# Altium schematic sheet 03_Battery Management.SchDoc
size A3; SheetNumber: 3; SheetTotal: 14
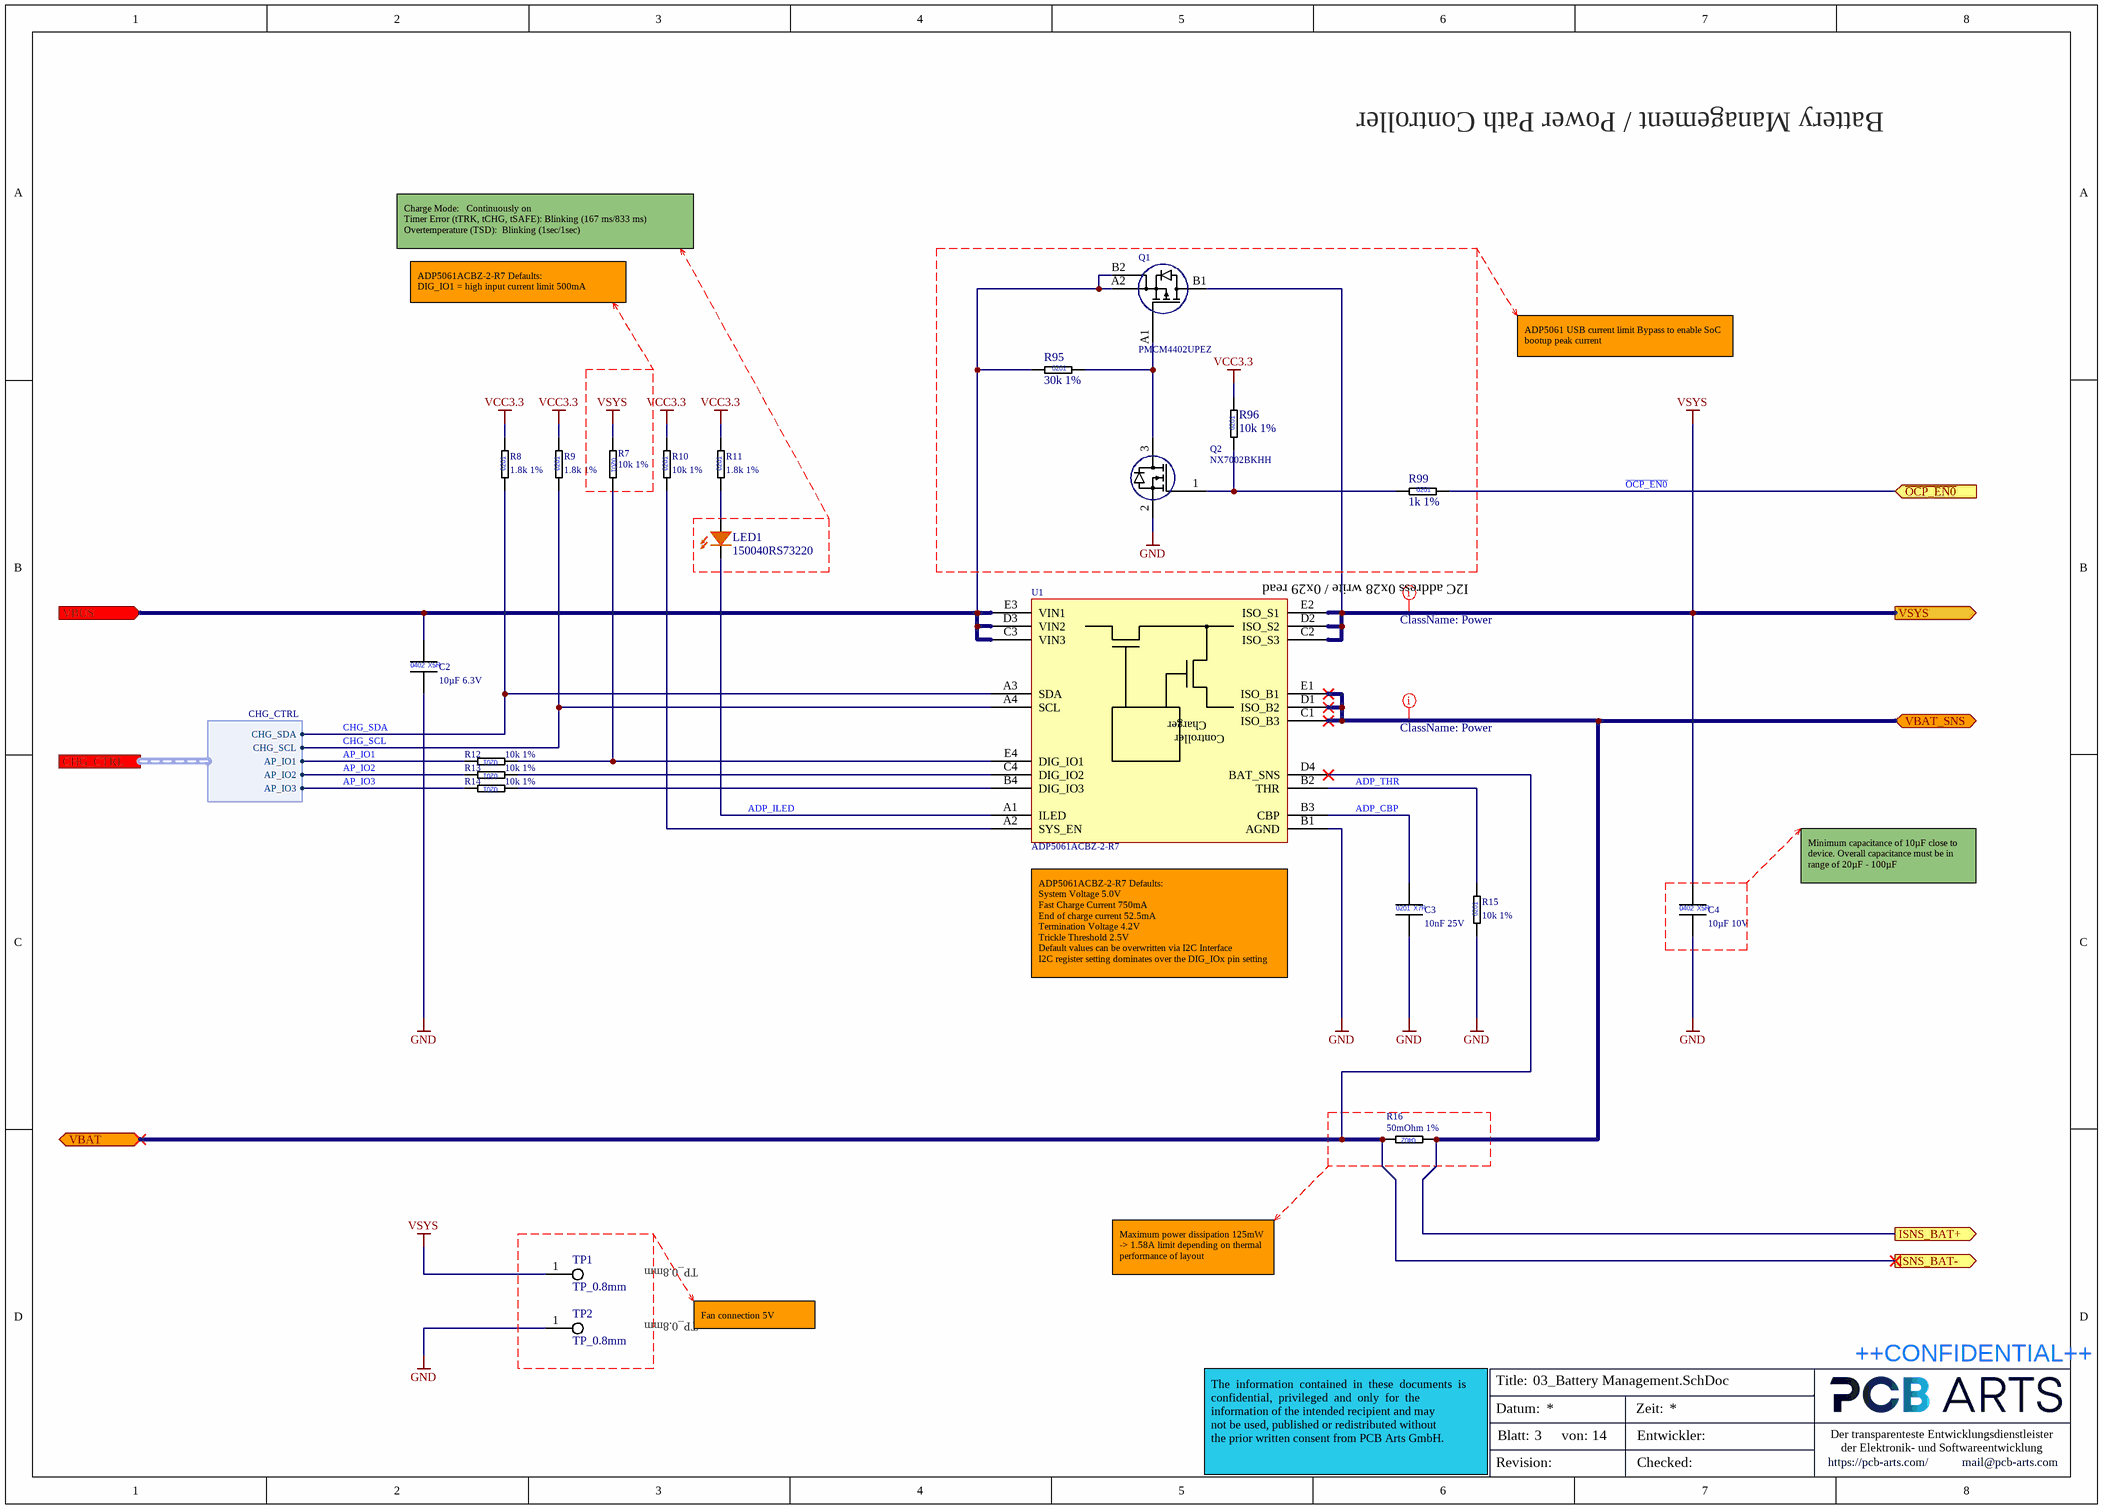
[diagram p0: 03_Battery Management.SchDoc]

## Parts
C2  10µF 6.3V  [CAPC1005X06L]
C3  10nF 25V  [CAPC0603X03L]
C4  10µF 10V  [CAPC1005X06L]
LED1  150040RS73220  [WL-SMCC_0402_H=0.25mm]
Q1  PMCM4402UPEZ  [BGA4C40P2X2_78X78X38]
Q2  NX7002BKHH  [DFN0606-3]
R7  10k 1%  [RESC0603X03L]
R8  1.8k 1%  [RESC0603X03L]
R9  1.8k 1%  [RESC0603X03L]
R10  10k 1%  [RESC0603X03L]
R11  1.8k 1%  [RESC0603X03L]
R12  10k 1%  [RESC0603X03L]
R13  10k 1%  [RESC0603X03L]
R14  10k 1%  [RESC0603X03L]
R15  10k 1%  [RESC0603X03L]
R16  50mOhm 1%  [RESC1005X04L]
R95  30k 1%  [RESC0603X03L]
R96  10k 1%  [RESC0603X03L]
R99  1k 1%  [RESC0603X03L]
TP1  TP_0.8mm  [TP_0.8mm]  (no BOM)
TP2  TP_0.8mm  [TP_0.8mm]  (no BOM)
U1  ADP5061ACBZ-2-R7  [BGA20C50P4X5_200X260X66]

## Ports
CHG_CTRL (harness CHG_CTRL), ISNS_BAT+ (out), ISNS_BAT- (out), VBAT (bidir), VBAT_SNS (bidir), VBUS (in), VSYS (out), ~{OCP_EN0} (in)

## Harnesses
CHG_CTRL: CHG_SDA, CHG_SCL, AP_IO1, AP_IO2, AP_IO3

## Nets
GND: C2.2 C3.2 C4.2 Q2.2(Source) R15.1 TP2.1 U1.B1(AGND)
VCC3.3: R8.2 R9.2 R10.2 R11.2 R96.2
VSYS: C4.1 Q1.B1(Drain) R7.1 TP1.1 U1.C2(ISO_S3) U1.D2(ISO_S2) U1.E2(ISO_S1) ; port VSYS
ADP_CBP: C3.1 U1.B3(CBP)
ADP_ILED: LED1.1 U1.A1(ILED)
ADP_THR: R15.2 U1.B2(THR)
AP_IO1: R12.2 ; port CHG_CTRL.AP_IO1
AP_IO2: R13.2 ; port CHG_CTRL.AP_IO2
AP_IO3: R14.2 ; port CHG_CTRL.AP_IO3
CHG_SCL: R9.1 U1.A4(SCL) ; port CHG_CTRL.CHG_SCL
CHG_SDA: R8.1 U1.A3(SDA) ; port CHG_CTRL.CHG_SDA
ISNS_BAT+: R16.1 U1.C1(ISO_B3) U1.D1(ISO_B2) U1.E1(ISO_B1) ; port ISNS_BAT+, port VBAT_SNS
ISNS_BAT-: R16.2 U1.D4(BAT_SNS) ; port VBAT, port ISNS_BAT-
~{OCP_EN0}: R99.2 ; port ~{OCP_EN0}
VBUS: C2.1 Q1.A2(Source) Q1.B2(Source) R95.1 U1.C3(VIN3) U1.D3(VIN2) U1.E3(VIN1) ; port VBUS
NetLED1_2: LED1.2 R11.1
NetQ1_A1: Q1.A1(Gate) Q2.3(Drain) R95.2
NetQ2_1: Q2.1(Gate) R96.1 R99.1
NetR7_2: R7.2 R12.1 U1.E4(DIG_IO1)
NetR10_1: R10.1 U1.A2(SYS_EN)
NetR13_1: R13.1 U1.C4(DIG_IO2)
NetR14_1: R14.1 U1.B4(DIG_IO3)

## Layout directives
net class Power: ISNS_BAT+, VSYS

## Notes on the sheet
- Battery Management / Power Path Controller
- Charge Mode:			Continuously on
  Timer Error (tTRK, tCHG, tSAFE):	Blinking (167 ms/833 ms)
  Overtemperature (TSD):		Blinking (1sec/1sec)
- ADP5061ACBZ-2-R7 Defaults:
  DIG_IO1 = high	input current limit 500mA
- ADP5061 USB current limit Bypass to enable SoC bootup peak current
- (near U1) I2C address 0x28 write / 0x29 read
- Minimum capacitance of 10µF close to device. Overall capacitance must be in range of 20µF - 100µF
- (near U1) ADP5061ACBZ-2-R7 Defaults:
  System Voltage	5.0V
  Fast Charge Current	750mA
  End of charge current	52.5mA
  Termination Voltage	4.2V
  Trickle Threshold	2.5V
  Default values can be overwritten via I2C Interface
  I2C register setting dominates over the DIG_IOx pin setting
- Fan connection 5V
- Maximum power dissipation 125mW
  -> 1.58A limit depending on thermal performance of layout
- Title:
- ++CONFIDENTIAL++
- Datum:
- Blatt:
- von:
- Zeit:
- Entwickler:
- Der transparenteste Entwicklungsdienstleister
  der Elektronik- und Softwareentwicklung
- The  information  contained  in  these  documents  is  confidential,  privileged  and  only  for  the
  information of the intended recipient and may
  not be used, published or redistributed without
  the prior written consent from PCB Arts GmbH.
- Revision:
- Checked:
- https://pcb-arts.com/
- mail@pcb-arts.com
- (in symbol ADP5061ACBZ-2-R7_I2C Programmable, Linear Battery Charger) Charger; Controller
- (in symbol CAP_0201_10nF_25V) 0201; X7R
- (in symbol CAP_0402_10µ_6.3V) 0402; X5R
- (in symbol CAP_0402_10µ_10V) 0402; X5R
- (in symbol RES_0201_1.8k_1%) 0201
- (in symbol RES_0201_1k_1%) 0201
- (in symbol RES_0201_10k_1%) 0201
- (in symbol RES_0201_30k_1%) 0201
- (in symbol RES_0402_50mR_1%) 0402

## Library data of the parts
C2 = CAP_0402_10µ_6.3V: Multilayer Ceramic Capacitors MLCC - SMD/SMT 0402 6.3VDC; Manufacturer 1: Murata Electronics; Manufacturer 1 Prt. Nr.: GRM155C80J106ME11J; Manufacturer 2 Prt. Nr.: JMK105CBJ106MV-F; Manufacturer 2: Taiyo Yuden
C3 = CAP_0201_10nF_25V: Multilayer Ceramic Capacitors MLCC - SMD/SMT 0201 25VDC; Manufacturer 1: Murata Electronics; Manufacturer 1 Prt. Nr.: GRM033C81E103KE14D; Manufacturer 2 Prt. Nr.: 02013C103KAT2A; Manufacturer 2: AVX
C4 = CAP_0402_10µ_10V: Multilayer Ceramic Capacitors MLCC - SMD/SMT 0402 10VDC; Manufacturer 1: Murata Electronics; Manufacturer 1 Prt. Nr.: GRM155R61A475MEAAD; Manufacturer 2 Prt. Nr.: LMK105BBJ475MVLF; Manufacturer 2: Taiyo Yuden
LED1 = 150040RS73220_SMD WL-SMCC SMT LED Mono-color: Standard LEDs - SMD WL-SMCC SMT LED Mono-color; Manufacturer 1: Wurth Elektronik; Manufacturer 1 Prt. Nr.: 150040RS73220
Q1 = PMCM4402UPEZ_PMOS 20V P-channel Trench MOSFET: 20 V, P-channel Trench MOSFET; Manufacturer 1: Nexperia; Manufacturer 1 Prt. Nr.: PMCM4402UPEZ
Q2 = NX7002BKHH_NMOS 60V N-channel Trench MOSFET: 60 V, N-channel Trench MOSFET 2.8Ohm; Manufacturer 1: Nexperia; Manufacturer 1 Prt. Nr.: NX7002BKHH
R7 R10 R12-R15 R96 = RES_0201_10k_1%: Thick Film Resistors - SMD 10K OHM 1%; Manufacturer 1: Yageo; Manufacturer 1 Prt. Nr.: RC0201FR-0710KL; Manufacturer 2 Prt. Nr.: CRCW020110K0FNED; Manufacturer 2: Vishay / Dale
R8 R9 R11 = RES_0201_1.8k_1%: Thick Film Resistors - SMD 1.8K OHM 1%; Manufacturer 1: Panasonic; Manufacturer 1 Prt. Nr.: ERJ-1GNF1801C; Manufacturer 2 Prt. Nr.: CRCW02011K80FKED; Manufacturer 2: Vishay / Dale
R16 = RES_0402_50mR_1%: Thick Film Resistors - SMD 50mOHM 1%; Manufacturer 1: Panasonic; Manufacturer 1 Prt. Nr.: ERJ-2BWJR051X
R95 = RES_0201_30k_1%: Thick Film Resistors - SMD 30K OHM 1%; Manufacturer 1: Yageo; Manufacturer 1 Prt. Nr.: RC0201JR-0730KL; Manufacturer 2 Prt. Nr.: CRCW020130K0FNED; Manufacturer 2: Vishay / Dale
R99 = RES_0201_1k_1%: Thick Film Resistors - SMD 1K OHM 1%; Manufacturer 1: Yageo; Manufacturer 1 Prt. Nr.: RC0201FR-071KL; Manufacturer 2 Prt. Nr.: CRCW02011K00FNED; Manufacturer 2: Vishay / Dale
TP1 TP2 = TP_0.8mm_Tespoint: Testpoint 0.8mm diameter, with 3D Mark
U1 = ADP5061ACBZ-2-R7_I2C Programmable, Linear Battery Charger: Tiny, I2C Programmable, Linear Battery Charger with Power Path and USB Mode Compatibility; Manufacturer 1: Analog Devices; Manufacturer 1 Prt. Nr.: ADP5061ACBZ-2-R7